# Altium project cocube_maix.PrjPcb
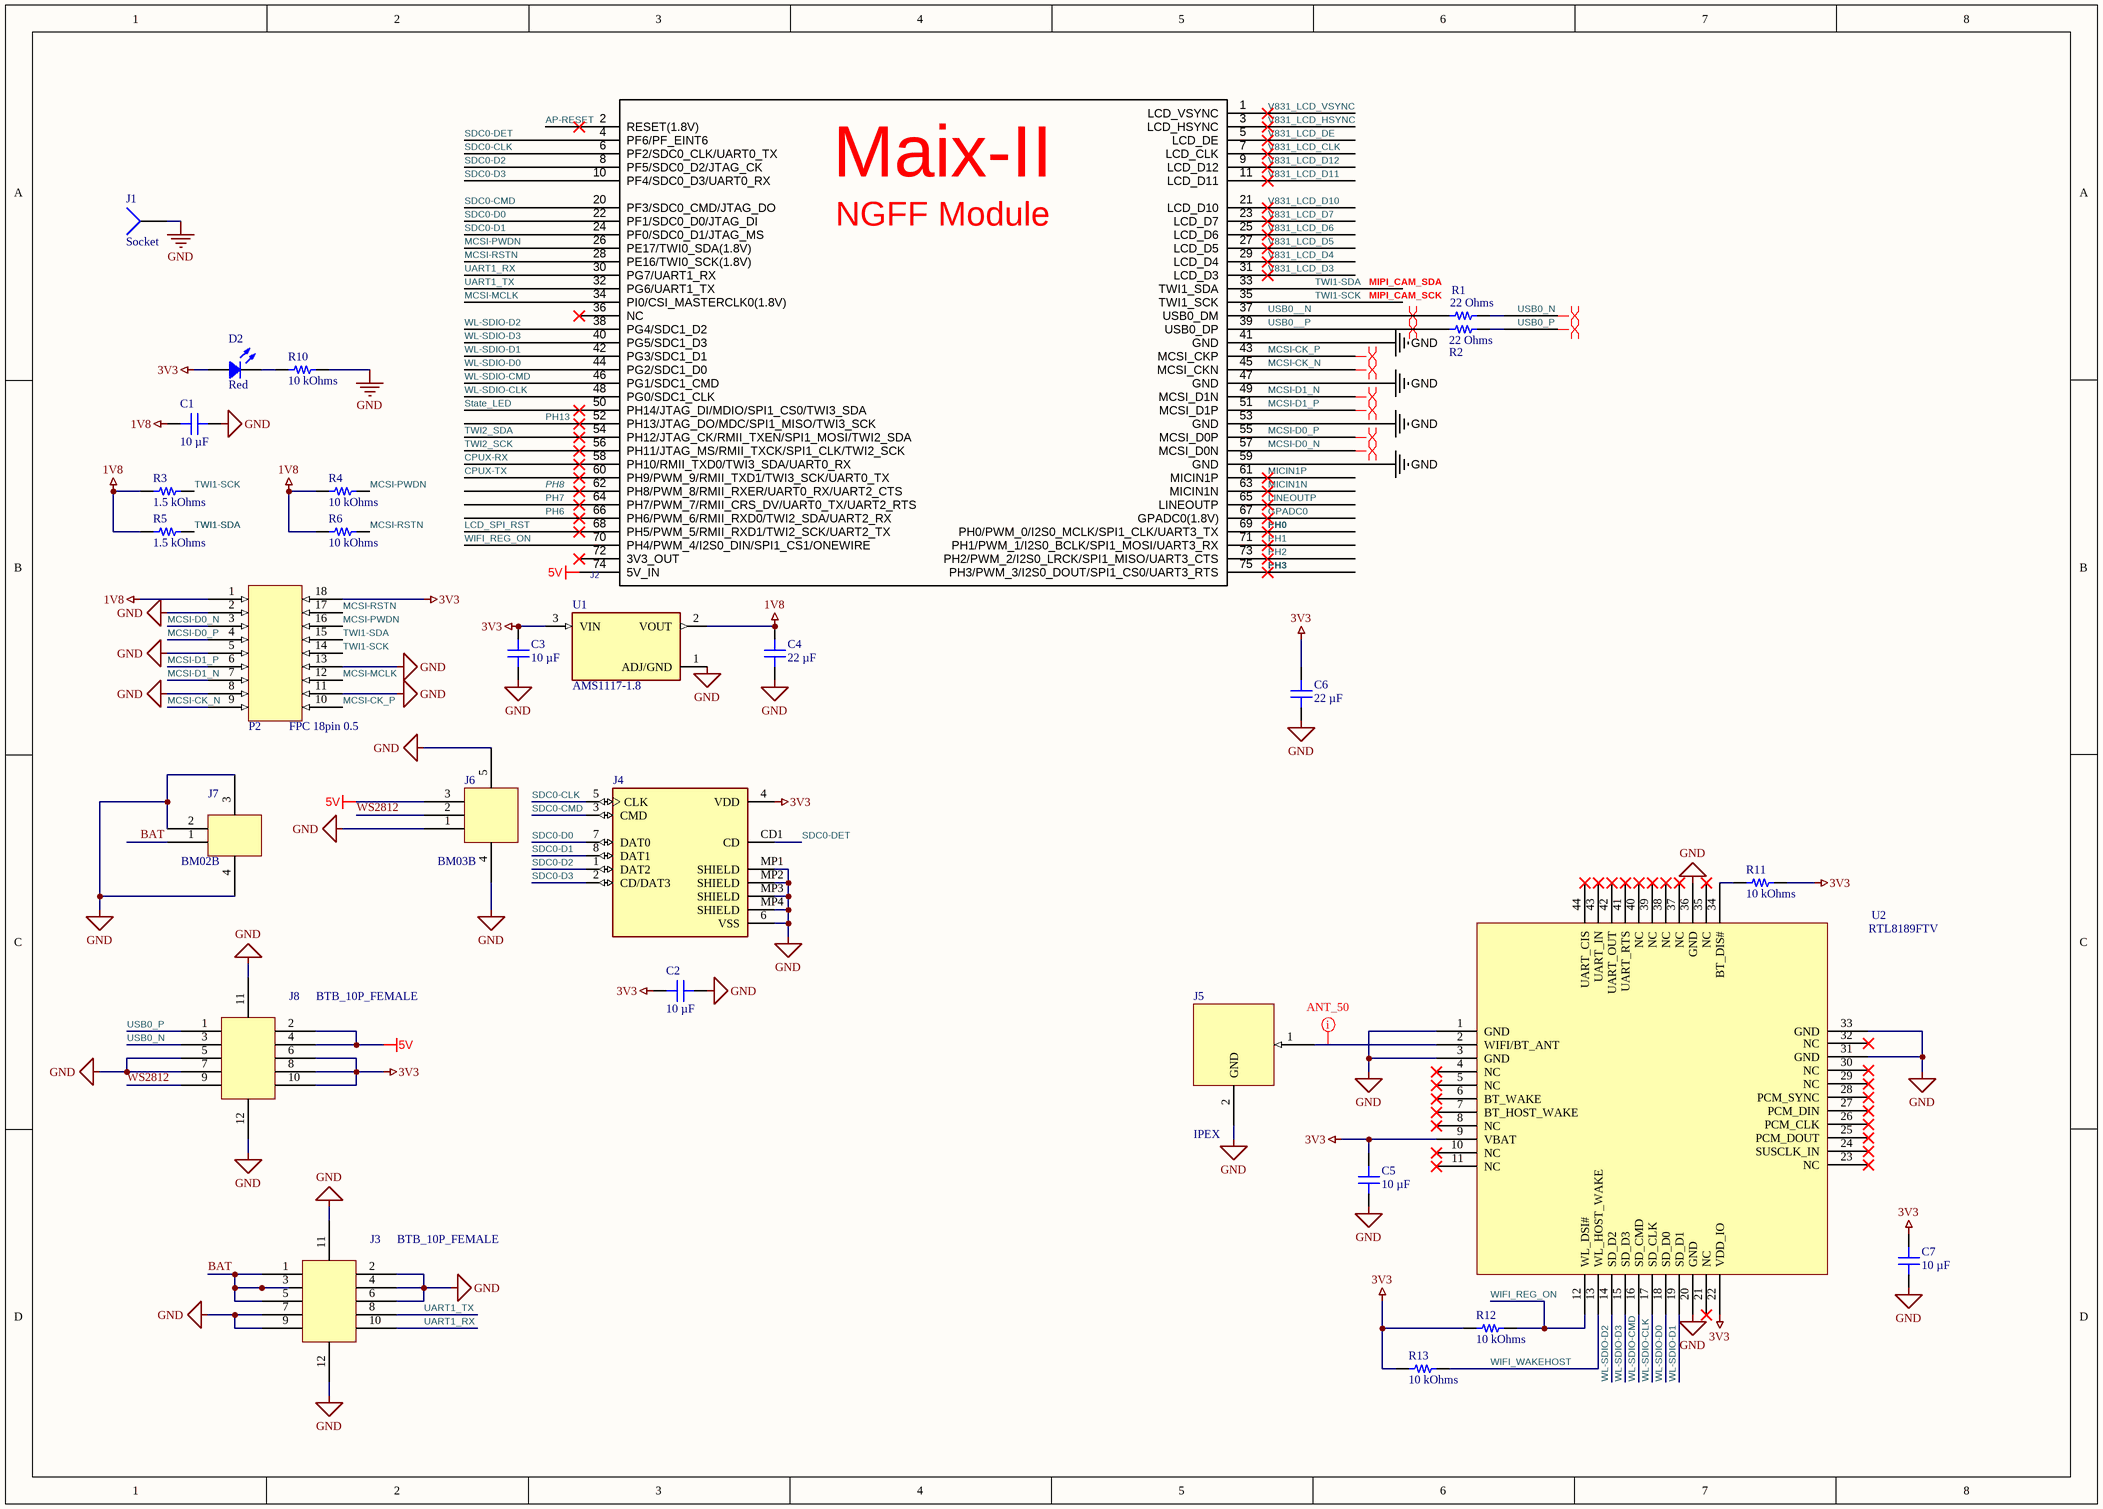
[diagram p0: Sheet1.SchDoc]
1 sheet, 29 parts. Net scope: global (net labels, ports and power ports of the same name join across sheets).
Board file: PCB1.PcbDoc

## Sheet Sheet1.SchDoc
size A3; SheetNumber: 1; SheetTotal: 1

### Parts
C1  10 µF  [CAP 0402_1005]
C2  10 µF  [CAP 0402_1005]
C3  10 µF  [CAP 0402_1005]
C4  22 µF  [CAP_TAN_A1206]
C5  10 µF  [CAP 0402_1005]
C6  22 µF  [CAP_TAN_A1206]
C7  10 µF  [CAP 0402_1005]
D2  Red  [LED_0603_RED]
J1  Socket  [M.2 SMT-FEMALE - FULL]
J2  NGFF-67P_B-KEY座子 4.2H高  [M2-67P0R50_B_FEMALE]  (value not drawn)  (no BOM)
J3  BTB_10P_FEMALE  [BTB_10P_FEMALE]
J4  TF-01A  [TF-01A]  (value not drawn)
J5  IPEX  [IPEX]
J6  BM03B  [BM03B]
J7  BM02B  [BM02B]
J8  BTB_10P_FEMALE  [BTB_10P_FEMALE]
P2  FPC 18pin 0.5  [FPC 18PIN STAND]
R1  22 Ohms  [RES 0402_1005]
R2  22 Ohms  [RES 0402_1005]
R3  1.5 kOhms  [RES 0402_1005]
R4  10 kOhms  [RES 0402_1005]
R5  1.5 kOhms  [RES 0402_1005]
R6  10 kOhms  [RES 0402_1005]
R10  10 kOhms  [RES 0402_1005]
R11  10 kOhms  [RES 0402_1005]
R12  10 kOhms  [RES 0402_1005]
R13  10 kOhms  [RES 0402_1005]
U1  AMS1117-1.8  [SOT89-3]
U2  RTL8189FTV  [FT89FMST13]

### Nets
1V8: C1.1 C4.1 P2.1 R3.1 R4.1 R5.1 R6.1 U1.2(VOUT)
3V3: C2.1 C3.1 C5.1 C6.1 C7.1 D2.1 J4.4(VDD) J8.6 J8.8 J8.10 P2.18 R11.2 R12.1 R13.1 U1.3(VIN) U2.9(VBAT) U2.22(VDD_IO)
5V: J2.74(5V_IN) J6.3 J8.2 J8.4
GND: C1.2 C2.2 C3.2 C4.2 C5.2 C6.2 C7.2 J1.1 J2.41(GND) J2.47(GND) J2.53(GND) J2.59(GND) J3.2 J3.4 J3.6 J3.7 J3.9 J3.11 J3.12 J4.6(VSS) J4.MP1(SHIELD) J4.MP2(SHIELD) J4.MP3(SHIELD) J4.MP4(SHIELD) J5.2(GND) J6.1 J6.4 J6.5 J7.2 J7.3 J7.4 J8.5 J8.7 J8.11 J8.12 P2.2 P2.5 P2.8 P2.11 P2.13 R10.2 U1.1(ADJ/GND) U2.1(GND) U2.3(GND) U2.20(GND) U2.31(GND) U2.33(GND) U2.36(GND)
AP-RESET: J2.2(RESET(1.8V))
BAT: J3.1 J3.3 J3.5 J7.1
CPUX-RX: J2.58(PH10/RMII_TXD0/TWI3_SDA/UART0_RX)
CPUX-TX: J2.60(PH9/PWM_9/RMII_TXD1/TWI3_SCK/UART0_TX)
GPADC0: J2.67(GPADC0(1.8V))
LCD_SPI_RST: J2.68(PH5/PWM_5/RMII_RXD1/TWI2_SCK/UART2_TX)
LINEOUTP: J2.65(LINEOUTP)
MCSI-CK_N: J2.45(MCSI_CKN) P2.9
MCSI-CK_P: J2.43(MCSI_CKP) P2.10
MCSI-D0_N: J2.57(MCSI_D0N) P2.3
MCSI-D0_P: J2.55(MCSI_D0P) P2.4
MCSI-D1_N: J2.49(MCSI_D1N) P2.7
MCSI-D1_P: J2.51(MCSI_D1P) P2.6
MCSI-MCLK: J2.34(PI0/CSI_MASTERCLK0(1.8V)) P2.12
MCSI-PWDN: J2.26(PE17/TWI0_SDA(1.8V)) P2.16 R4.2
MCSI-RSTN: J2.28(PE16/TWI0_SCK(1.8V)) P2.17 R6.2
MICIN1N: J2.63(MICIN1N)
MICIN1P: J2.61(MICIN1P)
PH0: J2.69(PH0/PWM_0/I2S0_MCLK/SPI1_CLK/UART3_TX)
PH1: J2.71(PH1/PWM_1/I2S0_BCLK/SPI1_MOSI/UART3_RX)
PH2: J2.73(PH2/PWM_2/I2S0_LRCK/SPI1_MISO/UART3_CTS)
PH3: J2.75(PH3/PWM_3/I2S0_DOUT/SPI1_CS0/UART3_RTS)
PH6: J2.66(PH6/PWM_6/RMII_RXD0/TWI2_SDA/UART2_RX)
PH7: J2.64(PH7/PWM_7/RMII_CRS_DV/UART0_TX/UART2_RTS)
PH8: J2.62(PH8/PWM_8/RMII_RXER/UART0_RX/UART2_CTS)
PH13: J2.52(PH13/JTAG_DO/MDC/SPI1_MISO/TWI3_SCK)
SDC0-CLK: J2.6(PF2/SDC0_CLK/UART0_TX) J4.5(CLK)
SDC0-CMD: J2.20(PF3/SDC0_CMD/JTAG_DO) J4.3(CMD)
SDC0-D0: J2.22(PF1/SDC0_D0/JTAG_DI) J4.7(DAT0)
SDC0-D1: J2.24(PF0/SDC0_D1/JTAG_MS) J4.8(DAT1)
SDC0-D2: J2.8(PF5/SDC0_D2/JTAG_CK) J4.1(DAT2)
SDC0-D3: J2.10(PF4/SDC0_D3/UART0_RX) J4.2(CD/DAT3)
SDC0-DET: J2.4(PF6/PF_EINT6) J4.CD1(CD)
State_LED: J2.50(PH14/JTAG_DI/MDIO/SPI1_CS0/TWI3_SDA)
TWI1-SCK: J2.35(TWI1_SCK) P2.14 R3.2
TWI1-SDA: J2.33(TWI1_SDA) P2.15 R5.2
TWI2_SCK: J2.56(PH11/JTAG_MS/RMII_TXCK/SPI1_CLK/TWI2_SCK)
TWI2_SDA: J2.54(PH12/JTAG_CK/RMII_TXEN/SPI1_MOSI/TWI2_SDA)
UART1_RX: J2.30(PG7/UART1_RX) J3.10
UART1_TX: J2.32(PG6/UART1_TX) J3.8
USB0__N: J2.37(USB0_DM) R1.1
USB0__P: J2.39(USB0_DP) R2.1
USB0_N: J8.3 R1.2
USB0_P: J8.1 R2.2
V831_LCD_CLK: J2.7(LCD_CLK)
V831_LCD_D3: J2.31(LCD_D3)
V831_LCD_D4: J2.29(LCD_D4)
V831_LCD_D5: J2.27(LCD_D5)
V831_LCD_D6: J2.25(LCD_D6)
V831_LCD_D7: J2.23(LCD_D7)
V831_LCD_D10: J2.21(LCD_D10)
V831_LCD_D11: J2.11(LCD_D11)
V831_LCD_D12: J2.9(LCD_D12)
V831_LCD_DE: J2.5(LCD_DE)
V831_LCD_HSYNC: J2.3(LCD_HSYNC)
V831_LCD_VSYNC: J2.1(LCD_VSYNC)
WIFI_REG_ON: J2.70(PH4/PWM_4/I2S0_DIN/SPI1_CS1/ONEWIRE) R12.2 U2.12(WL_DSI#)
WIFI_WAKEHOST: R13.2 U2.13(WL_HOST_WAKE)
WL-SDIO-CLK: J2.48(PG0/SDC1_CLK) U2.17(SD_CLK)
WL-SDIO-CMD: J2.46(PG1/SDC1_CMD) U2.16(SD_CMD)
WL-SDIO-D0: J2.44(PG2/SDC1_D0) U2.18(SD_D0)
WL-SDIO-D1: J2.42(PG3/SDC1_D1) U2.19(SD_D1)
WL-SDIO-D2: J2.38(PG4/SDC1_D2) U2.14(SD_D2)
WL-SDIO-D3: J2.40(PG5/SDC1_D3) U2.15(SD_D3)
WS2812: J6.2 J8.9
NetD2_2: D2.2 R10.1
NetJ5_1: J5.1 U2.2(WIFI/BT_ANT)
NetR11_1: R11.1 U2.34(BT_DIS#)

Not connected (* = marked no-connect by the designer): J2 36(NC)* 72(3V3_OUT)*; U2 4(NC)* 5(NC)* 6(BT_WAKE)* 7(BT_HOST_WAKE)* 8(NC)* 10(NC)* 11(NC)* 21(NC)* 23(NC)* 24(SUSCLK_IN)* 25(PCM_DOUT)* 26(PCM_CLK)* 27(PCM_DIN)* 28(PCM_SYNC)* 29(NC)* 30(NC)* 32(NC)* 35(NC)* 37(NC)* 38(NC)* 39(NC)* 40(NC)* 41(UART_RTS)* 42(UART_OUT)* 43(UART_IN)* 44(UART_CIS)*

### Layout directives
differential pair; differential pair class MIPI: MCSI-CK_N, MCSI-CK_P, MCSI-D0_N, MCSI-D0_P, MCSI-D1_N, MCSI-D1_P
differential pair: USB0__N, USB0__P, USB0_N, USB0_P
net class ANT_50: NetJ5_1

### Notes on the sheet
- MIPI_CAM_SDA
- MIPI_CAM_SCK
- (in symbol NGFF-67P_B-MALE) Maix-II; NGFF Module

### Library data of the parts
C1-C3 C5 C7 = GRM155R60E106ME16D: CAP CER 10UF 2.5V X5R 0402; manufacturer: Murata Electronics; Tolerance: ±20%; Part Number: GRM155R60E106ME16D; Value: 10 µF; Applications: General Purpose; Capacitance: 10 µF; componentlink1description: Datasheet; componentlink1url: https://search.murata.co.jp/Ceramy/image/img/A01X/G101/ENG/GRM155R60E106ME16-01.pdf; componentlink2description: DigiKey Link; componentlink2url: https://www.digikey.com/en/products/detail/murata-electronics/GRM155R60E106ME16D/4905100; Device Package: 0402 (1005 Metric); lastupdated: 2022/9/14 7:46:00; Lifecycle Status: Active; Minimum Order: 1; Mounting Type: Surface Mount, MLCC; Operating Temperature: -55°C ~ 85°C; Package / Case: 0402 (1005 Metric); packaging: TapeAndReel; partid: 6704; Part Status: Active; price: 0.02; series: GRM; Size / Dimension: 0.039" L x 0.020" W (1.00mm x 0.50mm); Supplier 1: DigiKey; Supplier Part Number 1: 490-10692-1-ND; Temperature Coefficient: X5R; Thickness (Max): 0.028" (0.70mm); Voltage - Rated: 2.5V
C4 C6 = GRM155R60E106ME16D: CAP CER 10UF 2.5V X5R 0402; manufacturer: Murata Electronics; Capacitance: 10 µF; Tolerance: ±20%; Part Number: GRM155R60E106ME16D; Value: 22 µF; Applications: General Purpose; componentlink1description: Datasheet; componentlink1url: https://search.murata.co.jp/Ceramy/image/img/A01X/G101/ENG/GRM155R60E106ME16-01.pdf; componentlink2description: DigiKey Link; componentlink2url: https://www.digikey.com/en/products/detail/murata-electronics/GRM155R60E106ME16D/4905100; Device Package: 0402 (1005 Metric); lastupdated: 2022/9/14 7:46:00; Lifecycle Status: Active; Minimum Order: 1; Mounting Type: Surface Mount, MLCC; Operating Temperature: -55°C ~ 85°C; Package / Case: 0402 (1005 Metric); packaging: TapeAndReel; partid: 6704; Part Status: Active; price: 0.02; series: GRM; Size / Dimension: 0.039" L x 0.020" W (1.00mm x 0.50mm); Supplier 1: DigiKey; Supplier Part Number 1: 490-10692-1-ND; Temperature Coefficient: X5R; Thickness (Max): 0.028" (0.70mm); Voltage - Rated: 2.5V
D2 = QBLP595-R-2897: 0402 LED RED, CLEAR LENS, 330MCD; Manufacturer: QT Brightek (QTB); Configuration: Standard; Current - Test: 20mA; Lens Color: Colorless; Lens Size: 0.70mm x 0.50mm; Lens Style: Rectangle with Flat Top; Viewing Angle: 120°; Voltage - Forward (Vf) (Typ): 2.1V; Wavelength - Dominant: 620nm; Part Number: QBLP595-R-2897; Color: Red; ComponentLink1Description: Datasheet; ComponentLink1URL: https://www.qt-brightek.com/datasheet/QBLP595-R-2897.pdf; ComponentLink2Description: DigiKey Link; ComponentLink2URL: https://www.digikey.com/en/products/detail/qt-brightek-qtb/QBLP595-R-2897/16499677; Device Package: 0402 (1005 Metric); Height (Max): 0.60mm; LastUpdated: 2022/9/14 8:36:36; Lens Transparency: Clear; Lifecycle Status: Active; Millicandela Rating: 330mcd; Minimum Order: 1; Mounting Type: Surface Mount; Package / Case: 0402 (1005 Metric); Packaging: TapeAndReel; PartId: 1086; Part Status: Active; Price: 0.07; Series: QBLP595; Size / Dimension: 1.00mm L x 0.50mm W; Supplier 1: DigiKey; Supplier Part Number 1: 1516-QBLP595-R-2897CT-ND; Supplier Device Package: 0402; Value: Red
J2 = NGFF-67P_B-MALE
J4 = TF-01A: <b>Connector - Card Sockets 8 1.1mm SMD RoHS</b><p> Source: <a href="https://datasheet.lcsc.com/szlcsc/1903221101_Korean-Hroparts-Elec-TF-01A_C91145.pdf"> Datasheet </a>; MF: {'manufacturer': u'HRO Electronics Co., Ltd.'}; Availability: Unavailable; MP: TF-01A; Price: None; Package: None; Value: *
R1 R2 = SR0402FR-7W22RL: RES 22 OHM 1% 1/8W 0402; Manufacturer: Yageo; Power (Watts): 0.125W, 1/8W; Temperature Coefficient: ±100ppm/°C; Part Number: SR0402FR-7W22RL; Value: 22 Ohms; ComponentLink1Description: Datasheet; ComponentLink1URL: http://www.yageo.com/documents/recent/PYu-SR_D_F%20tol_RoHS_L_4.pdf; ComponentLink2Description: DigiKey Link; ComponentLink2URL: https://www.digikey.com/en/products/detail/yageo/SR0402FR-7W22RL/9373094; Composition: Thick Film; Device Package: 0402 (1005 Metric); Features: Automotive AEC-Q200, Pulse Withstanding; Height - Seated (Max): 0.016" (0.40mm); LastUpdated: 2022/9/14 8:02:27; Lifecycle Status: Active; Minimum Order: 1; Number of Terminations: 2; Operating Temperature: -55°C ~ 155°C; Package / Case: 0402 (1005 Metric); Packaging: TapeAndReel; PartId: 4390; Part Status: Active; Price: 0.07; Ratings: AEC-Q200; Resistance: 22 Ohms; Series: SR; Size / Dimension: 0.039" L x 0.020" W (1.00mm x 0.50mm); Supplier 1: DigiKey; Supplier Part Number 1: YAG5820CT-ND; Supplier Device Package: 0402; Tolerance: ±1%
R3 R5 = PTN0402Y1501BST1: PTN0402 10PPM 1.5K 0.1% S T1 E1; Manufacturer: Vishay Dale Thin Film; Power (Watts): 0.05W, 1/20W; Temperature Coefficient: ±10ppm/°C; Part Number: PTN0402Y1501BST1; Value: 1.5 kOhms; ComponentLink1Description: Datasheet; ComponentLink1URL: https://www.vishay.com/docs/60026/ptn.pdf; ComponentLink2Description: DigiKey Link; ComponentLink2URL: https://www.digikey.com/en/products/detail/vishay-dale-thin-film/PTN0402Y1501BST1/12820654; Composition: Thin Film; Device Package: 0402 (1005 Metric); Features: Anti-Sulfur, Moisture Resistant, Non-Inductive; Height - Seated (Max): 0.033" (0.84mm); LastUpdated: 2022/9/14 8:01:19; Lifecycle Status: Active; Minimum Order: 1; Number of Terminations: 2; Operating Temperature: -55°C ~ 155°C; Package / Case: 0402 (1005 Metric); Packaging: TapeAndReel; PartId: 59552; Part Status: Active; Price: 0.27; Resistance: 1.5 kOhms; Series: PTN; Size / Dimension: 0.042" L x 0.022" W (1.07mm x 0.56mm); Supplier 1: DigiKey; Supplier Part Number 1: 764-PTN0402Y1501BST1CT-ND; Supplier Device Package: 0402; Tolerance: ±0.1%
R4 R6 R11-R13 = P2TC0402D1002LNTA: P2TC0402 2PPM/C 10K 0,01% N TA; Manufacturer: Vishay Sfernice; Power (Watts): 0.063W, 1/16W; Temperature Coefficient: ±2ppm/°C; Tolerance: ±0.01%; Part Number: P2TC0402D1002LNTA; Value: 10 kOhms; ComponentLink1Description: Datasheet; ComponentLink1URL: https://www.vishay.com/docs/53080/p2tc.pdf; ComponentLink2Description: DigiKey Link; ComponentLink2URL: https://www.digikey.com/en/products/detail/vishay-sfernice/P2TC0402D1002LNTA/11657715; Composition: Thin Film; Device Package: 0402 (1005 Metric); Features: Anti-Sulfur, Moisture Resistant; Height - Seated (Max): 0.025" (0.63mm); LastUpdated: 2022/9/14 8:01:18; Lifecycle Status: Active; Minimum Order: 1; Number of Terminations: 2; Operating Temperature: -55°C ~ 155°C; Package / Case: 0402 (1005 Metric); Packaging: TapeAndReel; PartId: 59061; Part Status: Active; Price: 13.14; Resistance: 10 kOhms; Series: P2TC; Size / Dimension: 0.039" L x 0.024" W (1.00mm x 0.60mm); Supplier 1: DigiKey; Supplier Part Number 1: 716-P2TC0402D1002LNTACT-ND; Supplier Device Package: 0402
R10 = RP73PF1E10KBTD: RES 10K OHM 0.1% 1/10W 0402; Manufacturer: TE Connectivity Passive Product; Power (Watts): 0.1W, 1/10W; Temperature Coefficient: ±25ppm/°C; Part Number: RP73PF1E10KBTD; Value: 10 kOhms; ComponentLink1Description: Datasheet; ComponentLink1URL: https://www.te.com/commerce/DocumentDelivery/DDEController?Action=srchrtrv&DocNm=1773272&DocType=DS&DocLang=English; ComponentLink2Description: DigiKey Link; ComponentLink2URL: https://www.digikey.com/en/products/detail/te-connectivity-passive-product/RP73PF1E10KBTD/8260957; Composition: Thin Film; Device Package: 0402 (1005 Metric); Height - Seated (Max): 0.014" (0.35mm); LastUpdated: 2022/9/14 8:02:33; Lifecycle Status: Active; Minimum Order: 1; Number of Terminations: 2; Operating Temperature: -55°C ~ 155°C; Package / Case: 0402 (1005 Metric); Packaging: TapeAndReel; PartId: 2434; Part Status: Active; Price: 0.09; Resistance: 10 kOhms; Series: RP73, Holsworthy; Size / Dimension: 0.039" L x 0.020" W (1.00mm x 0.50mm); Supplier 1: DigiKey; Supplier Part Number 1: A127415CT-ND; Supplier Device Package: 0402; Tolerance: ±0.1%
U1 = AMS1117: Sot223/Pkg 1-Amp 5-Volt Low Drop Out Voltage Regulatator; MF: {'manufacturer': u'Advanced Monolithic Systems'}; Availability: Unavailable; Price: None; Value: *; MP: AMS1117; Package: None
J1 = Socket: LatestRevisionDate: 17-Jul-2002; LatestRevisionNote: Re-released for DXP Platform.; Publisher: Altium Limited